# Altium project CalibradorDePlacas.PrjPcb
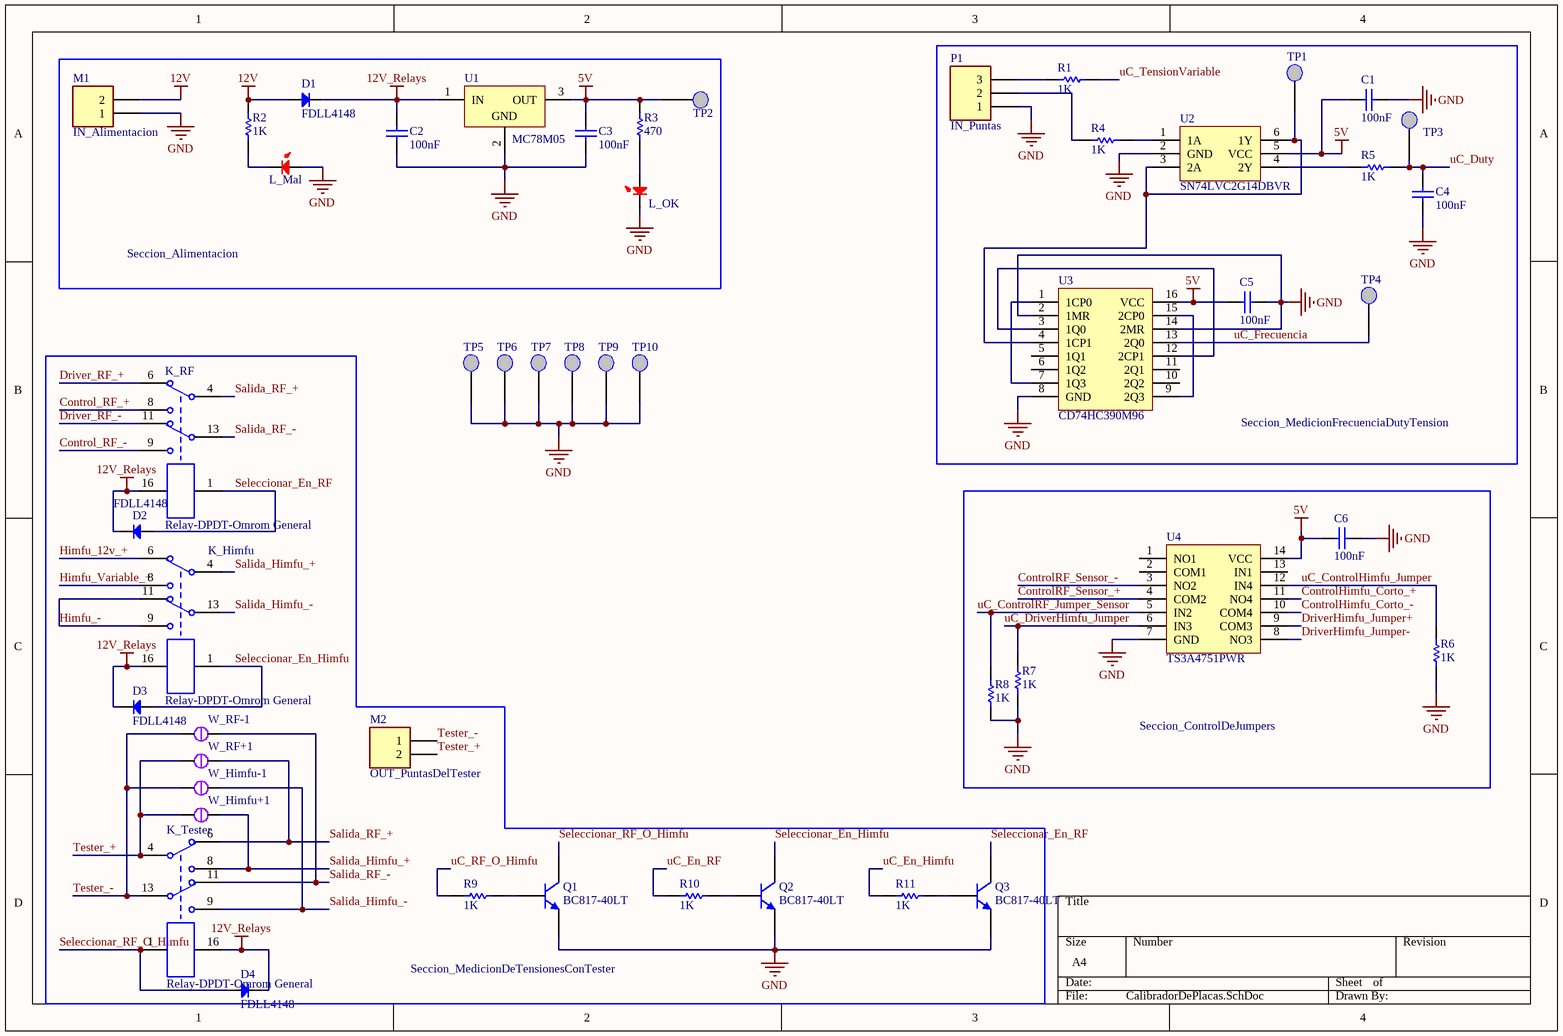
[diagram p0: CalibradorDePlacas.SchDoc]
4 sheets, 127 parts. Net scope: global (net labels, ports and power ports of the same name join across sheets).
Board file: CalibradorDePlacas.PcbDoc
Sheets:
  CalibradorDePlacas.SchDoc
  SeccionMicrocontrolador.SchDoc
  SeccionRF.SchDoc
  SeccionHimfu.SchDoc

## Sheet CalibradorDePlacas.SchDoc
size A4

### Parts
C1  100nF  [C_0805]
C2  100nF  [C_0805]
C3  100nF  [C_0805]
C4  100nF  [C_0805]
C5  100nF  [C_0805]
C6  100nF  [C_0805]
D1  FDLL4148  [SOD-80/MLL34]
D2  FDLL4148  [SOD-80/MLL34]
D3  FDLL4148  [SOD-80/MLL34]
D4  FDLL4148  [SOD-80/MLL34]
K_Himfu  Relay-DPDT-Omrom General  [RELAY_DPDT]
K_RF  Relay-DPDT-Omrom General  [RELAY_DPDT]
K_Tester  Relay-DPDT-Omrom General  [RELAY_DPDT]
L_Mal  PinesParaLed  [Jumper-Simple]  (value not drawn)
L_OK  PinesParaLed  [Jumper-Simple]  (value not drawn)
M1  IN_Alimentacion  [B2B-XH-A_3D]
M2  OUT_PuntasDelTester  [B2B-XH-A_3D]
P1  IN_Puntas  [B3B-XH-A_3D]
Q1  BC817-40LT  [SOT23]
Q2  BC817-40LT  [SOT23]
Q3  BC817-40LT  [SOT23]
R1  1K  [R_0805]
R2  1K  [R_0805]
R3  470  [R_0805]
R4  1K  [R_0805]
R5  1K  [R_0805]
R6  1K  [R_0805]
R7  1K  [R_0805]
R8  1K  [R_0805]
R9  1K  [R_0805]
R10  1K  [R_0805]
R11  1K  [R_0805]
TP1  IN_F  [TP-5002]  (value not drawn)
TP2  5V  [TP-5002]  (value not drawn)
TP3  OUT_D  [TP-5002]  (value not drawn)
TP4  OUT_F  [TP-5002]  (value not drawn)
TP5  GND  [TP-5002]  (value not drawn)
TP6  GND  [TP-5002]  (value not drawn)
TP7  GND  [TP-5002]  (value not drawn)
TP8  GND  [TP-5002]  (value not drawn)
TP9  GND  [TP-5002]  (value not drawn)
TP10  GND  [TP-5002]  (value not drawn)
U1  MC78M05  [TO-252AA_N]
U2  SN74LVC2G14DBVR  [SOT23-6]
U3  CD74HC390M96  [SOIC16]
U4  TS3A4751PWR  [TSSOP14]
W_Himfu+1  JMP  [SMD_JMP]  (value not drawn)
W_Himfu-1  JMP  [SMD_JMP]  (value not drawn)
W_RF+1  JMP  [SMD_JMP]  (value not drawn)
W_RF-1  JMP  [SMD_JMP]  (value not drawn)

### Blocks framed on the sheet
Seccion_Alimentacion: C2 C3 D1 L_Mal L_OK M1 R2 R3 TP2 U1
Seccion_MedicionFrecuenciaDutyTension: C1 C4 C5 P1 R1 R4 R5 TP1 TP3 TP4 U2 U3
Seccion_MedicionDeTensionesConTester: D2-D4 K_Himfu K_RF K_Tester M2 Q1-Q3 R9-R11 W_Himfu+1 W_Himfu-1 W_RF+1 W_RF-1
Seccion_ControlDeJumpers: C6 R6-R8 U4

### Nets
5V: C1.1 C3.2 C5.1 C6.1 R3.2 TP2.1 U1.3(OUT) U2.5(VCC) U3.16(VCC) U4.14(VCC)
12V: D1.1(A) M1.2 R2.2
12V_Relays: C2.2 D1.2(K) D2.2(K) D3.2(K) D4.2(K) K_Himfu.16(-) K_RF.16(-) K_Tester.16(-) U1.1(IN)
GND: C1.2 C2.1 C3.1 C4.1 C5.2 C6.2 L_Mal.1 L_OK.2 M1.1 P1.1 Q1.2(E) Q2.2(E) Q3.2(E) R6.1 R7.1 R8.1 TP5.1 TP6.1 TP7.1 TP8.1 TP9.1 TP10.1 U1.2(GND) U2.2(GND) U3.2(1MR) U3.8(GND) U3.14(2MR) U4.7(GND)
Control_RF_+: K_RF.8(NOb)
Control_RF_-: K_RF.9(NOa)
ControlHimfu_Corto_+: U4.11(NO4)
ControlHimfu_Corto_-: U4.10(COM4)
ControlRF_Sensor_+: U4.4(COM2)
ControlRF_Sensor_-: U4.3(NO2)
Driver_RF_+: K_RF.6(NCb)
Driver_RF_-: K_RF.11(NCa)
DriverHimfu_Jumper+: U4.9(COM3)
DriverHimfu_Jumper-: U4.8(NO3)
Himfu_12v_+: K_Himfu.6(NCb)
Himfu_-: K_Himfu.9(NOa) K_Himfu.11(NCa)
Himfu_Variable_+: K_Himfu.8(NOb)
Salida_Himfu_+: K_Himfu.4(Cb) K_Tester.8(NOb) W_Himfu+1.2
Salida_Himfu_-: K_Himfu.13(Ca) K_Tester.9(NOa) W_Himfu-1.2
Salida_RF_+: K_RF.4(Cb) K_Tester.6(NCb) W_RF+1.2
Salida_RF_-: K_RF.13(Ca) K_Tester.11(NCa) W_RF-1.2
Seleccionar_En_Himfu: D3.1(A) K_Himfu.1(+) Q2.3(C)
Seleccionar_En_RF: D2.1(A) K_RF.1(+) Q3.3(C)
Seleccionar_RF_O_Himfu: D4.1(A) K_Tester.1(+) Q1.3(C)
Tester_+: K_Tester.4(Cb) M2.2 W_Himfu+1.1 W_RF+1.1
Tester_-: K_Tester.13(Ca) M2.1 W_Himfu-1.1 W_RF-1.1
uC_ControlHimfu_Jumper: R6.2 U4.12(IN4)
uC_ControlRF_Jumper_Sensor: R8.2 U4.5(IN2)
uC_DriverHimfu_Jumper: R7.2 U4.6(IN3)
uC_Duty: C4.2 R5.2 TP3.1
uC_En_Himfu: R11.1
uC_En_RF: R10.1
uC_Frecuencia: TP4.1 U3.13(2Q0)
uC_RF_O_Himfu: R9.1
uC_TensionVariable: R1.2
NetL_Mal_2: L_Mal.2 R2.1
NetL_OK_1: L_OK.1 R3.1
NetP1_2: P1.2 R4.1
NetP1_3: P1.3 R1.1
NetQ1_1: Q1.1(B) R9.2
NetQ2_1: Q2.1(B) R10.2
NetQ3_1: Q3.1(B) R11.2
NetR4_2: R4.2 U2.1(1A)
NetR5_1: R5.1 U2.4(2Y)
NetTP1_1: TP1.1 U2.3(2A) U2.6(1Y) U3.4(1CP1)
NetU3_1: U3.1(1CP0) U3.7(1Q3)
NetU3_3: U3.3(1Q0) U3.12(2CP1)
NetU3_9: U3.9(2Q3) U3.15(2CP0)

Not connected (* = marked no-connect by the designer): U3 5(1Q1) 6(1Q2) 10(2Q2) 11(2Q1); U4 1(NO1) 2(COM1) 13(IN1)

### Library data of the parts
C1-C6 = C_100nF: CAP CER 0.1UF 25V X7R 0805; Note: Footprint corresponds to dimensions for bulk cassette packaging. This case size has tightened tolerances.; Cod.Fabricante: C0805C104M3RACTU; Fabricante: KEMET; Published: 17-Jul-2002; LatestRevisionDate: 19-Mar-2004; LatestRevisionNote: Silkscreen size reduced.; DatasheetDocument: Mar-2001; PackageDocument: Mar-2001; PackageReference: 0805; Publisher: Altium Limited; ComponentLink1Description: Manufacturer Link; ComponentLink1URL: http://www.kemet.com/; ComponentLink2Description: Datasheet; ComponentLink2URL: https://content.kemet.com/datasheets/KEM_C1002_X7R_SMD.pdf; Cod.Digikey: 399-8000-1-ND; Value: 100nF; DIGIKEYx100: 0.03160
D1-D4 = Diode FDLL4148: DIODE GEN PURP 100V 200MA LL34/SOD80/MINI MELF; Fabricante: ON Semiconductor; Published: 8-Jun-2000; LatestRevisionDate: 17-Jul-2002; LatestRevisionNote: Re-released for DXP Platform.; DatasheetDocument: 1998; PackageDocument: Aug-1999; PackageReference: MINI MELF; Publisher: Altium Limited; Code_JEDEC: MINI MELF; ComponentLink1Description: Manufacturer Link; ComponentLink1URL: https://www.fairchildsemi.com; ComponentLink2Description: Datasheet; ComponentLink2URL: https://www.fairchildsemi.com/datasheets/FD/FDLL4148.pdf; Value: FDLL4148; Cod.Digikey: FDLL4148CT-ND; Cod.Fabricante: FDLL4148; DIGIKEYx100: 0.0487
K_Himfu K_RF K_Tester = Relay-DPDT-Omrom General: RELAY GEN PURPOSE DPDT 1A 12VDC; Fabricante: Omron Electronics Inc-EMC Div; Cod.Fabricante: G5V-2-H1 DC12; Published: 24-Mar-1999; LatestRevisionDate: 17-Jul-2002; LatestRevisionNote: Re-released for DXP Platform.; PackageReference: DIP-P8; Publisher: Altium Limited; PackageDescription: Relay; 8 Leads; Cod.Digikey: Z109-ND; DIGIKEYx100: 2.38630
L_Mal L_OK = PinesParaLed: CONN HEADER 2 POS 2.54; Cod.Fabricante: 61300211121; Fabricante: Wurth Electronics Inc.; Cod.DigiKey: 732-5315-ND; ComponentLink1Description: Manufacturer Link; ComponentLink1URL: https://katalog.we-online.de/em/datasheet/6130xx11121.pdf; ComponentLink2Description: Datasheet; ComponentLink2URL: *; DatasheetVersion: *; DIGIKEYx100: 0.06700; LatestRevisionDate: *; LatestRevisionNote: *; PackageDescription: *; PackageReference: *; PackageVersion: *; Published: 29-sep-00; Publisher: Altium Limited; Value: *
M1 M2 = JST_2.5_2: CONN HEADER XH TOP 2POS 2.5MM; Cod.Fabricante: B2B-XH-A(LF)(SN); Fabricante: JST Sales America Inc.; LatestRevisionDate: 17-Jul-2002; LatestRevisionNote: Re-released for DXP Platform.; Publisher: Altium Limited; Cod.Digikey: 455-2247-ND; DIGIKEYx100: 0.0868; ComponentLink2URL: http://www.jst-mfg.com/product/pdf/eng/eXH.pdf; ComponentLink2Description: Datasheet
P1 = JST_2.5_3: CONN HEADER XH TOP 3POS 2.5MM; Cod.Fabricante: B3B-XH-A(LF)(SN); Fabricante: JST Sales America Inc.; LatestRevisionDate: 17-Jul-2002; LatestRevisionNote: Re-released for DXP Platform.; Publisher: Altium Limited; Cod.Digikey: 455-2248-ND; ComponentLink2Description: Datasheet; ComponentLink2URL: http://www.jst-mfg.com/product/pdf/eng/eXH.pdf; DIGIKEYx100: 0.1115
Q1-Q3 = BC817: TRANS NPN 45V 0.5A SOT23; Cod.Fabricante: BC817-40LT1G; Fabricante: ON Semiconductor; Published: 8-Jun-2000; LatestRevisionDate: 15-Jan-2003; LatestRevisionNote: PCB Footprint 'BCY-W3/D4.7' replaced; DatasheetVersion: 1997; PackageVersion: Sep-1998; PackageReference: SOT-23-3; Publisher: Altium Limited; PackageDescription: TO, Flat Index; 3 In-Line, Axial Leads; Body Dia. 4.5mm; Leads 0.51 x 0.48 mm (max); ComponentLink1Description: Manufacturer Link; ComponentLink1URL: http://www.onsemi.com/; ComponentLink2Description: Datasheet; ComponentLink2URL: http://www.onsemi.com/pub/Collateral/BC817-16LT1-D.PDF; Value: BC817-40LT; Cod.Digikey: BC817-40LT1GOSCT-ND; DIGIKEYx100: 0.08810
R1 R2 R4-R11 = R_1k: RES SMD 1K OHM 1% 1/8W 0805; Cod.Fabricante: RC0805FR-071KL; Fabricante: Yageo; Published: 8-Jun-2000; LatestRevisionDate: 17-Jul-2002; LatestRevisionNote: Re-released for DXP Platform.; PackageReference: 0805; Publisher: Altium Limited; Cod.Digikey: 311-1.00KCRCT-ND; Value: 1K; DIGIKEYx100: 0.01630
R3 = R_470: RES SMD 470 OHM 1% 1/8W 0805; Cod.Fabricante: RC0805FR-07470RL; Fabricante: Yageo; Published: 8-Jun-2000; LatestRevisionDate: 17-Jul-2002; LatestRevisionNote: Re-released for DXP Platform.; PackageReference: 0805; Publisher: Altium Limited; Cod.Digikey: 311-470CRCT-ND; Value: 470; DIGIKEYx100: 0.01630
TP1-TP10 = TestPoint: White PC Test Point, Miniature Phosphor Bronze, Silver Plating 0.040" (1.02mm) Hole Diameter Mounting Type; Cod.Fabricante: 5002; Fabricante: Keystone Electronics; Cod.DigiKey: 36-5002-ND; ComponentLink1Description: Manufacturer Link; ComponentLink1URL: http://www.keyelco.com/product-pdf.cfm?p=1311; ComponentLink2Description: Datasheet; ComponentLink2URL: *; DatasheetVersion: *; DIGIKEYx100: 0.22090; LatestRevisionDate: *; LatestRevisionNote: *; PackageDescription: *; PackageReference: *; PackageVersion: *; Published: 29-sep-00; Publisher: Altium Limited; Value: *
U1 = MC78M05: IC REG LINEAR 5V 500MA DPAK; Cod.Fabricante: MC78M05BDTRKG; Fabricante: ON Semiconductor; Published: 24-Aug-2001; LatestRevisionDate: 17-Jul-2002; LatestRevisionNote: Re-released for DXP Platform.; DatasheetVersion: Nov-1999; PackageReference: DPAK; Publisher: Altium Limited; PackageDescription: DPak (2 Leads + Tab); ComponentLink1Description: Manufacturer Link; ComponentLink1URL: http://www.onsemi.com; ComponentLink2Description: Datasheet; ComponentLink2URL: http://www.onsemi.com/pub/Collateral/MC78M00-D.PDF; Cod.Digikey: MC78M05BDTRKGOSCT-ND; DIGIKEYx100: 0.27660
U2 = SN74LVC2G14DBVR: IC INVERTER SCHMITT 2CH SOT23-6; Fabricante: Texas Instruments; Cod.DigiKey: 296-13010-1-ND; Cod.Fabricante: SN74LVC2G14DBVR; ComponentLink1Description: Manufacturer Link; ComponentLink1URL: http://www.ti.com/lit/ds/symlink/sn74lvc2g14.pdf; ComponentLink2Description: Datasheet; ComponentLink2URL: *; DatasheetVersion: O; DIGIKEYx100: 0.18240; LatestRevisionDate: *; LatestRevisionNote: *; PackageDescription: SOT-23-6; PackageReference: SOT-23-6; PackageVersion: *; Published: 29-sep-00; Publisher: Altium Limited; Value: SN74LVC2G14DBVR
U3 = CD74HC390M96: IC DUAL DECADE RPL COUNTR 16SOIC; Cod.DigiKey: 296-14526-1-ND; Cod.Fabricante: CD74HC390M96; ComponentLink1Description: Manufacturer Link; ComponentLink1URL: 0.43260; ComponentLink2Description: Datasheet; ComponentLink2URL: *; DatasheetVersion: *; DIGIKEYx100: 0.43260; Fabricante: *; LatestRevisionDate: *; LatestRevisionNote: *; PackageDescription: 16-SOIC (0.154", 3.90mm Width); PackageReference: 16-SOIC (0.154", 3.90mm Width); PackageVersion: *; Published: 29-sep-00; Publisher: Altium Limited; Value: CD74HC390M96
U4 = TS3A4751PWR: IC SWITCH QUAD SPST 14TSSOP; Fabricante: Texas Instruments; Cod.DigiKey: 296-20700-1-ND; Cod.Fabricante: TS3A4751PWR; ComponentLink1Description: Manufacturer Link; ComponentLink1URL: http://www.ti.com/lit/ds/symlink/ts3a4751.pdf; ComponentLink2Description: Datasheet; ComponentLink2URL: *; DatasheetVersion: F; DIGIKEYx100: 0.75680; LatestRevisionDate: *; LatestRevisionNote: *; PackageDescription: 14-TSSOP; PackageReference: 14-TSSOP; PackageVersion: *; Published: 29-sep-00; Publisher: Altium Limited; Value: TS3A4751PWR
W_Himfu+1 W_Himfu-1 W_RF+1 W_RF-1 = SMD_JMP: Islas para hacer un jumper con estaño

## Sheet SeccionMicrocontrolador.SchDoc
size A4
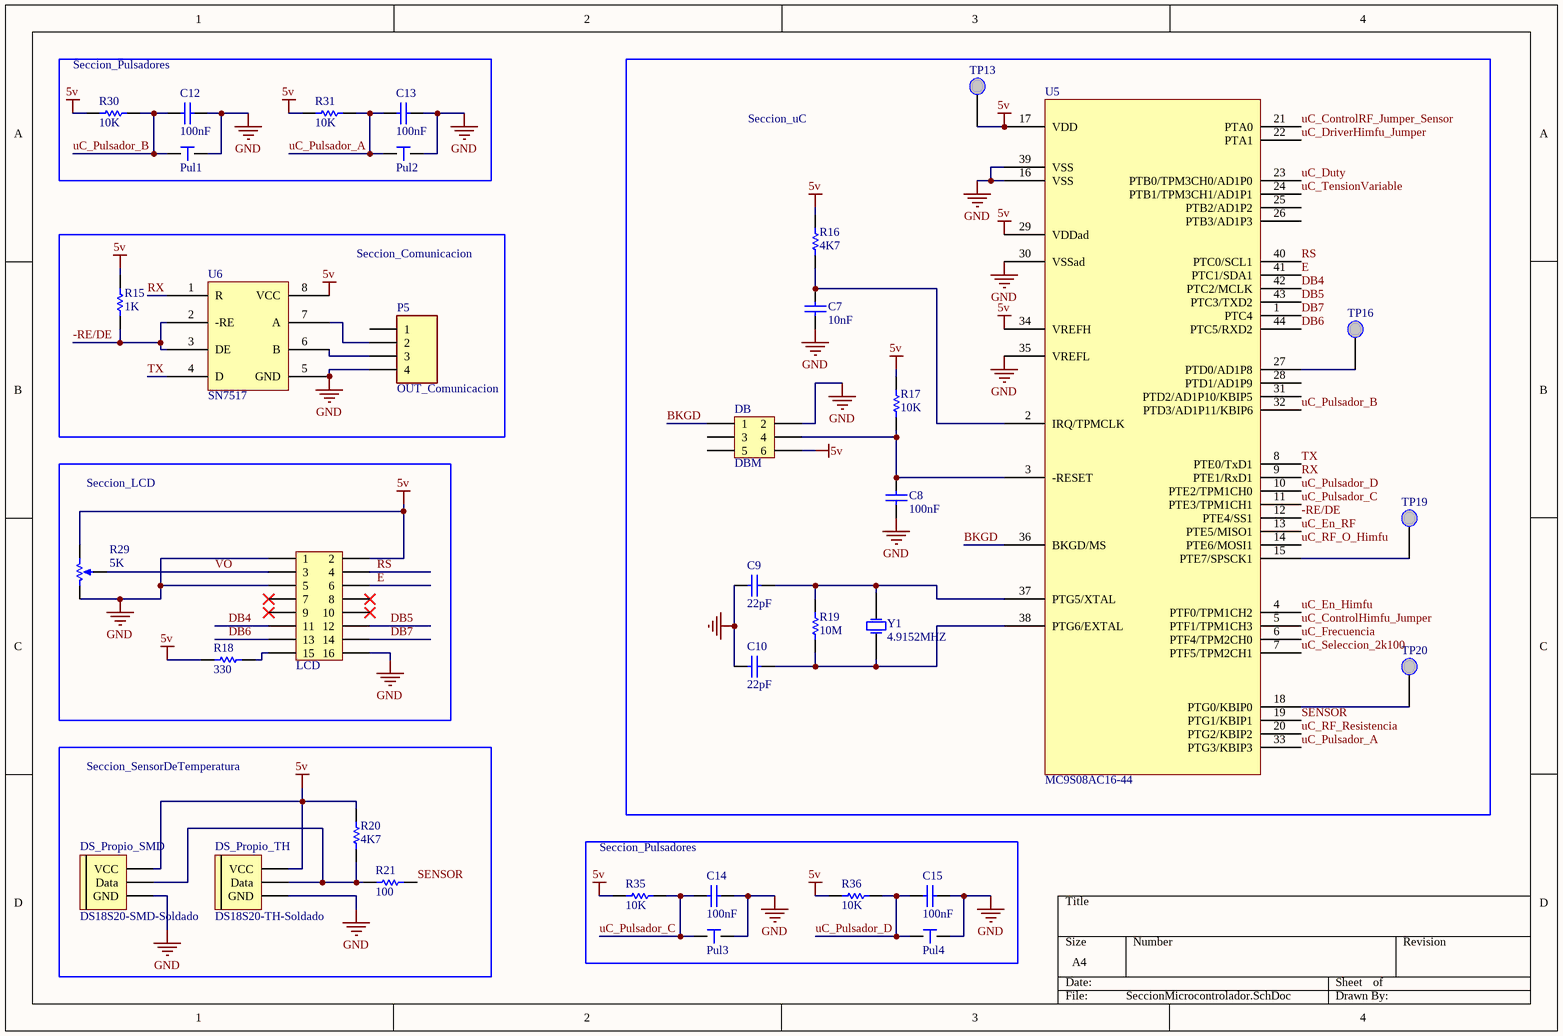
[diagram p1: SeccionMicrocontrolador.SchDoc]

### Parts
C7  10nF  [C_0805]
C8  100nF  [C_0805]
C9  22pF  [C_0805]
C10  22pF  [C_0805]
C12  100nF  [C_0805]
C13  100nF  [C_0805]
C14  100nF  [C_0805]
C15  100nF  [C_0805]
DB  DBM  [DBM]
DS_Propio_SMD  DS18S20-SMD-Soldado  [SOIC8]
DS_Propio_TH  DS18S20-TH-Soldado  [TO92]
LCD  LCD_Pines  [LCD_Pines]  (value not drawn)
P5  OUT_Comunicacion  [B4B-XH-A_3D]
Pul1  PinesParaPulsador  [Jumper-Simple]  (value not drawn)
Pul2  PinesParaPulsador  [Jumper-Simple]  (value not drawn)
Pul3  PinesParaPulsador  [Jumper-Simple]  (value not drawn)
Pul4  PinesParaPulsador  [Jumper-Simple]  (value not drawn)
R15  1K  [R_0805]
R16  4K7  [R_0805]
R17  10K  [R_0805]
R18  330  [R_0805]
R19  10M  [R_0805]
R20  4K7  [R_0805]
R21  100  [R_0805]
R29  5K  [Preset_SMD]
R30  10K  [R_0805]
R31  10K  [R_0805]
R35  10K  [R_0805]
R36  10K  [R_0805]
TP13  5V  [TP-5002]  (value not drawn)
TP16  PTD0  [TP-5002]  (value not drawn)
TP19  PTE7  [TP-5002]  (value not drawn)
TP20  PTG0  [TP-5002]  (value not drawn)
U5  MC9S08AC16-44  [QFP10x10-G44/Z14.4N]
U6  SN7517  [751-07_N]
Y1  4.9152MHZ  [XTAL_LOW]

### Blocks framed on the sheet
Seccion_Pulsadores: C12 C13 Pul1 Pul2 R30 R31
Seccion_uC: C7-C10 DB R16 R17 R19 TP13 TP16 TP19 TP20 U5 Y1
Seccion_Comunicacion: P5 R15 U6
Seccion_LCD: LCD R18 R29
Seccion_SensorDeTemperatura: DS_Propio_SMD DS_Propio_TH R20 R21
Seccion_Pulsadores: C14 C15 Pul3 Pul4 R35 R36

### Nets
5V: DB.6 DS_Propio_SMD.3(VCC) DS_Propio_TH.3(VCC) LCD.2 R15.2 R16.2 R17.2 R18.1 R20.2 R29.1(TOP_CCW) R30.2 R31.2 R35.2 R36.2 TP13.1 U5.17(VDD) U5.29(VDDad) U5.34(VREFH) U6.8(VCC)
GND: C7.1 C8.1 C9.1 C10.1 C12.1 C13.1 C14.1 C15.1 DB.2 DS_Propio_SMD.5(GND) DS_Propio_TH.1(GND) LCD.1 LCD.5 LCD.16 P5.4 Pul1.1 Pul2.1 Pul3.1 Pul4.1 R29.3(BOT_CW) U5.16(VSS) U5.30(VSSad) U5.35(VREFL) U5.39(VSS) U6.5(GND)
-RE/DE: R15.1 U5.12(PTE4/SS1) U6.2(-RE) U6.3(DE)
BKGD: DB.1 U5.36(BKGD/MS)
DB4: LCD.11 U5.42(PTC2/MCLK)
DB5: LCD.12 U5.43(PTC3/TXD2)
DB6: LCD.13 U5.44(PTC5/RXD2)
DB7: LCD.14 U5.1(PTC4)
E: LCD.6 U5.41(PTC1/SDA1)
RS: LCD.4 U5.40(PTC0/SCL1)
RX: U5.9(PTE1/RxD1) U6.1(R)
SENSOR: R21.2 U5.19(PTG1/KBIP1)
TX: U5.8(PTE0/TxD1) U6.4(D)
uC_ControlHimfu_Jumper: U5.5(PTF1/TPM1CH3)
uC_ControlRF_Jumper_Sensor: U5.21(PTA0)
uC_DriverHimfu_Jumper: U5.22(PTA1)
uC_Duty: U5.23(PTB0/TPM3CH0/AD1P0)
uC_En_Himfu: U5.4(PTF0/TPM1CH2)
uC_En_RF: U5.13(PTE5/MISO1)
uC_Frecuencia: U5.6(PTF4/TPM2CH0)
uC_Pulsador_A: C13.2 Pul2.2 R31.1 U5.33(PTG3/KBIP3)
uC_Pulsador_B: C12.2 Pul1.2 R30.1 U5.32(PTD3/AD1P11/KBIP6)
uC_Pulsador_C: C14.2 Pul3.2 R35.1 U5.11(PTE3/TPM1CH1)
uC_Pulsador_D: C15.2 Pul4.2 R36.1 U5.10(PTE2/TPM1CH0)
uC_RF_O_Himfu: U5.14(PTE6/MOSI1)
uC_RF_Resistencia: U5.20(PTG2/KBIP2)
uC_Seleccion_2k100: U5.7(PTF5/TPM2CH1)
uC_TensionVariable: U5.24(PTB1/TPM3CH1/AD1P1)
VO: LCD.3 R29.2(TAP)
NetC7_2: C7.2 R16.1 U5.2(IRQ/TPMCLK)
NetC8_2: C8.2 DB.4 R17.1 U5.3(-RESET)
NetC9_2: C9.2 R19.2 U5.37(PTG5/XTAL) Y1.2(OSC2)
NetC10_2: C10.2 R19.1 U5.38(PTG6/EXTAL) Y1.1(OSC1)
NetDS_Propio_SMD_4: DS_Propio_SMD.4(Data) DS_Propio_TH.2(Data) R20.1 R21.1
NetLCD_15: LCD.15 R18.2
NetP5_2: P5.2 U6.7(A)
NetP5_3: P5.3 U6.6(B)
NetTP16_1: TP16.1 U5.27(PTD0/AD1P8)
NetTP19_1: TP19.1 U5.15(PTE7/SPSCK1)
NetTP20_1: TP20.1 U5.18(PTG0/KBIP0)

Not connected (* = marked no-connect by the designer): DB 3 5; LCD 7* 8* 9* 10*; P5 1; U5 25(PTB2/AD1P2) 26(PTB3/AD1P3) 28(PTD1/AD1P9) 31(PTD2/AD1P10/KBIP5)

### Library data of the parts
C7 = C_10nF: CAP CER 10000PF 25V X7R 0805; Note: Footprint corresponds to dimensions for bulk cassette packaging. This case size has tightened tolerances.; Cod.Fabricante: C0805C103M3RACTU; Fabricante: KEMET; Published: 17-Jul-2002; LatestRevisionDate: 19-Mar-2004; LatestRevisionNote: Silkscreen size reduced.; DatasheetDocument: Mar-2001; PackageDocument: Mar-2001; PackageReference: 0805; Publisher: Altium Limited; ComponentLink1Description: Manufacturer Link; ComponentLink1URL: http://www.kemet.com/; ComponentLink2Description: Datasheet; ComponentLink2URL: *; Cod.Digikey: 399-9154-1-ND; Value: 10nF; DIGIKEYx100: 0.06930
C8 C12-C15 = C_100nF: as C1 on sheet CalibradorDePlacas; Published: 17-Jul-2002; LatestRevisionDate: 19-Mar-2004; LatestRevisionNote: Silkscreen size reduced.; DatasheetDocument: Mar-2001; PackageDocument: Mar-2001; PackageReference: 0805; Publisher: Altium Limited; ComponentLink1Description: Manufacturer Link; ComponentLink1URL: http://www.kemet.com/; ComponentLink2Description: Datasheet; ComponentLink2URL: https://content.kemet.com/datasheets/KEM_C1002_X7R_SMD.pdf; Cod.Digikey: 399-8000-1-ND; Value: 100nF; DIGIKEYx100: 0.03160
C9 C10 = C_22pF: CAP CER 22PF 50V C0G/NP0 0805; Note: Footprint corresponds to dimensions for bulk cassette packaging. This case size has tightened tolerances.; Cod.Fabricante: C0805C220J5GACTU; Fabricante: KEMET; Published: 17-Jul-2002; LatestRevisionDate: 19-Mar-2004; LatestRevisionNote: Silkscreen size reduced.; DatasheetDocument: Mar-2001; PackageDocument: Mar-2001; PackageReference: 0805; Publisher: Altium Limited; ComponentLink1Description: Manufacturer Link; ComponentLink1URL: http://www.kemet.com/; ComponentLink2Description: Datasheet; Cod.Digikey: 399-1113-1-ND; Value: 22pF; DIGIKEYx100: 0.03100
DB = DBM: CONN HEADER VERT 6POS 2.54MM; Cod.Fabricante: 4-103186-0-03; Fabricante: TE Connectivity AMP Connectors; Cod.DigiKey: A26529-03-ND; ComponentLink1Description: Manufacturer Link; ComponentLink1URL: https://www.te.com/commerce/DocumentDelivery/DDEController?Action=srchrtrv&DocNm=103186&DocType=Customer+Drawing&DocLang=English; ComponentLink2Description: Datasheet; ComponentLink2URL: *; DatasheetVersion: *; DIGIKEYx100: 0.44760; LatestRevisionDate: *; LatestRevisionNote: *; PackageDescription: *; PackageReference: *; PackageVersion: *; Published: 29-sep-00; Publisher: Altium Limited; Value: *
DS_Propio_SMD = DS18S20-SMD-Soldado: SENSOR DIGITAL -55C-125C 8SOIC; Cod.Fabricante: DS18S20Z+; Fabricante: Maxim Integrated; Cod.DigiKey: DS18S20Z+-ND; ComponentLink1Description: Manufacturer Link; ComponentLink1URL: https://datasheets.maximintegrated.com/en/ds/DS18S20.pdf; ComponentLink2Description: Datasheet; ComponentLink2URL: *; DatasheetVersion: *; DIGIKEYx10: 3.62160; LatestRevisionDate: *; LatestRevisionNote: *; PackageDescription: *; PackageReference: 8-SOIC; PackageVersion: *; Published: 29-sep-00; Publisher: Altium Limited; Value: DS18S20
DS_Propio_TH = DS18S20-TH-Soldado: Temperature Sensor Digital, Local -55°C ~ 125°C 8 b TO-92-3; Cod.Fabricante: DS18S20+; Fabricante: Maxim Integrated; Cod.DigiKey: DS18S20+-ND; ComponentLink1Description: Manufacturer Link; ComponentLink1URL: https://datasheets.maximintegrated.com/en/ds/DS18S20.pdf; ComponentLink2Description: Datasheet; ComponentLink2URL: *; DatasheetVersion: *; DIGIKEYx10: 2.96300; LatestRevisionDate: *; LatestRevisionNote: *; PackageDescription: *; PackageReference: TO92; PackageVersion: *; Published: 29-sep-00; Publisher: Altium Limited; Value: DS18S20
LCD = LCD_Pines: CONN HEADER VERT 16POS 2.54MM; Cod.Fabricante: 5-146257-8; Fabricante: TE Connectivity AMP Connectors; Cod.DigiKey: A121470-ND; ComponentLink1Description: Manufacturer Link; ComponentLink1URL: https://www.te.com/commerce/DocumentDelivery/DDEController?Action=srchrtrv&DocNm=103186&DocType=Customer+Drawing&DocLang=English; ComponentLink2Description: Datasheet; ComponentLink2URL: *; DatasheetVersion: *; DIGIKEYx100: 0.44760; LatestRevisionDate: *; LatestRevisionNote: *; PackageDescription: *; PackageReference: *; PackageVersion: *; Published: 29-sep-00; Publisher: Altium Limited; Value: *
P5 = JST_2.5_4: CONN HEADER XH TOP 4POS 2.5MM; Cod.Fabricante: B4B-XH-A(LF)(SN); Fabricante: JST Sales America Inc.; LatestRevisionDate: 17-Jul-2002; LatestRevisionNote: Re-released for DXP Platform.; Publisher: Altium Limited; Cod.Digikey: 455-2249-ND; ComponentLink2Description: Datasheet; ComponentLink2URL: http://www.jst-mfg.com/product/pdf/eng/eXH.pdf; DIGIKEYx100: 0.1348
Pul1-Pul4 = PinesParaPulsador: CONN HEADER 2 POS 2.54; Cod.Fabricante: 61300211121; Fabricante: Wurth Electronics Inc.; Cod.DigiKey: 732-5315-ND; ComponentLink1Description: Manufacturer Link; ComponentLink1URL: https://katalog.we-online.de/em/datasheet/6130xx11121.pdf; ComponentLink2Description: Datasheet; ComponentLink2URL: *; DatasheetVersion: *; DIGIKEYx100: 0.06700; LatestRevisionDate: *; LatestRevisionNote: *; PackageDescription: *; PackageReference: *; PackageVersion: *; Published: 29-sep-00; Publisher: Altium Limited; Value: *
R15 = R_1k: as R1 on sheet CalibradorDePlacas; Published: 8-Jun-2000; LatestRevisionDate: 17-Jul-2002; LatestRevisionNote: Re-released for DXP Platform.; PackageReference: 0805; Publisher: Altium Limited; Cod.Digikey: 311-1.00KCRCT-ND; Value: 1K; DIGIKEYx100: 0.01630
R16 R20 = R_4k7: RES SMD 4K7 OHM 1% 1/8W 0805; Cod.Fabricante: RC0805FR-074K7L; Fabricante: Yageo; Published: 8-Jun-2000; LatestRevisionDate: 17-Jul-2002; LatestRevisionNote: Re-released for DXP Platform.; PackageReference: 0805; Publisher: Altium Limited; Cod.Digikey: 311-4.70KCRCT-ND; Value: 4K7; DIGIKEYx100: 0.01630
R17 R30 R31 R35 R36 = R_10k: RES SMD 10K OHM 1% 1/8W 0805; Cod.Fabricante: RC0805FR-0710KL; Fabricante: Yageo; Published: 8-Jun-2000; LatestRevisionDate: 17-Jul-2002; LatestRevisionNote: Re-released for DXP Platform.; PackageReference: 0805; Publisher: Altium Limited; Cod.Digikey: 311-10.0KCRCT-ND; Value: 10K; DIGIKEYx100: 0.01630
R18 = R_330: RES SMD 330 OHM 1% 1/8W 0805; Cod.Fabricante: RC0805FR-07330RL; Fabricante: Yageo; Published: 8-Jun-2000; LatestRevisionDate: 17-Jul-2002; LatestRevisionNote: Re-released for DXP Platform.; PackageReference: 0805; Publisher: Altium Limited; Cod.Digikey: 311-330CRCT-ND; Value: 330; DIGIKEYx100: 0.01630
R19 = R_10M: RES SMD 10M OHM 5% 1/8W 0805; Cod.Fabricante: RC0805JR-0710ML; Fabricante: Yageo; Published: 8-Jun-2000; LatestRevisionDate: 17-Jul-2002; LatestRevisionNote: Re-released for DXP Platform.; PackageReference: 0805; Publisher: Altium Limited; Cod.Digikey: 311-10MARCT-ND; Value: 10M; DIGIKEYx100: 0.01400
R21 = R_100: RES SMD 100 OHM 1% 1/8W 0805; Cod.Fabricante: RC0805FR-07100RL; Fabricante: Yageo; Published: 8-Jun-2000; LatestRevisionDate: 17-Jul-2002; LatestRevisionNote: Re-released for DXP Platform.; PackageReference: 0805; Publisher: Altium Limited; Cod.Digikey: 311-100CRCT-ND; Value: 100; DIGIKEYx100: 0.01630
R29 = Preset_5k_SMD: TRIMMER 5K OHM 0.5W GW TOP ADJ; Cod.Fabricante: 3361P-1-502GLF; Fabricante: Bourns Inc.; Published: 8-Jun-2000; LatestRevisionDate: 17-Jul-2002; LatestRevisionNote: Re-released for DXP Platform.; PackageReference: VR5; Publisher: Altium Limited; PackageDescription: Variable Resistor, Thru-Hole; 3 Leads; Series: 3361P; Cod.Digikey: 3361P-502GLFCT-ND; DIGIKEYx100: 1.01750; Value: 5K
TP13 TP16 TP19 TP20 = TestPoint: as TP1 on sheet CalibradorDePlacas; Cod.DigiKey: 36-5002-ND; ComponentLink1Description: Manufacturer Link; ComponentLink1URL: http://www.keyelco.com/product-pdf.cfm?p=1311; ComponentLink2Description: Datasheet; ComponentLink2URL: *; DatasheetVersion: *; DIGIKEYx100: 0.22090; LatestRevisionDate: *; LatestRevisionNote: *; PackageDescription: *; PackageReference: *; PackageVersion: *; Published: 29-sep-00; Publisher: Altium Limited; Value: *
U5 = MC9S08AC16-44: S08 S08 Microcontroller IC 8-Bit 40MHz 16KB (16K x 8) FLASH 32-LQFP (7x7); Cod.Fabricante: MC9S08AC16CFGE; Fabricante: NXP; Cod.Digikey: MC9S08AC16CFGE-ND; ComponentLink1Description: Manufacturer Link; ComponentLink1URL: https://www.nxp.com/docs/en/data-sheet/MC9S08AC16.pdf; ComponentLink2Description: Datasheet; ComponentLink2URL: https://www.nxp.com/docs/en/data-sheet/MC9S08AC16.pdf; DatasheetVersion: Rev. 9; DIGIKEYx100: 4.1535; LatestRevisionDate: 8/2011; LatestRevisionNote: *; PackageDescription: *; PackageReference: *; PackageVersion: 44-LQFP; Published: *; Publisher: *; Value: MC9S08AC16-44
U6 = SN7517: IC TXRX DIFF BUSS 8SOIC; Cod.Fabricante: SN75176BDR; Fabricante: Texas Instruments; Cod.Digikey: 296-1275-1-ND; ComponentLink1Description: Manufacturer Link; ComponentLink1URL: http://www.ti.com/general/docs/suppproductinfo.tsp?distId=10&gotoUrl=http%3A%2F%2Fwww.ti.com%2Flit%2Fgpn%2Fsn65176b; ComponentLink2Description: Datasheet; ComponentLink2URL: http://www.ti.com/general/docs/suppproductinfo.tsp?distId=10&gotoUrl=http%3A%2F%2Fwww.ti.com%2Flit%2Fgpn%2Fsn65176b; DatasheetVersion: 1996; DIGIKEYx100: 1.55330; LatestRevisionDate: 17-jul-02; LatestRevisionNote: Re-released for DXP Platform.; PackageDescription: 8-SOIC; PackageReference: 8-SOIC; PackageVersion: 1996; Published: 29-sep-00; Publisher: Altium Limited; Value: SN7517
Y1 = XTAL_LOW: CRYSTAL 4.9152MHZ 18PF T/H; Cod.Fabricante: ATS049B-E; Fabricante: CTS-Frequency Controls; Cod.Digikey: CTX914-ND; ComponentLink1Description: *; ComponentLink1URL: *; ComponentLink2Description: Datasheet; ComponentLink2URL: https://www.ctscorp.com/wp-content/uploads/ATS-ATSSM.pdf; DatasheetVersion: Rev. M; DIGIKEYx100: 0.27000; LatestRevisionDate: *; LatestRevisionNote: *; PackageDescription: *; PackageReference: HC-49/US; PackageVersion: *; Published: *; Publisher: *; Value: 4.9152MHz

## Sheet SeccionRF.SchDoc
size A4
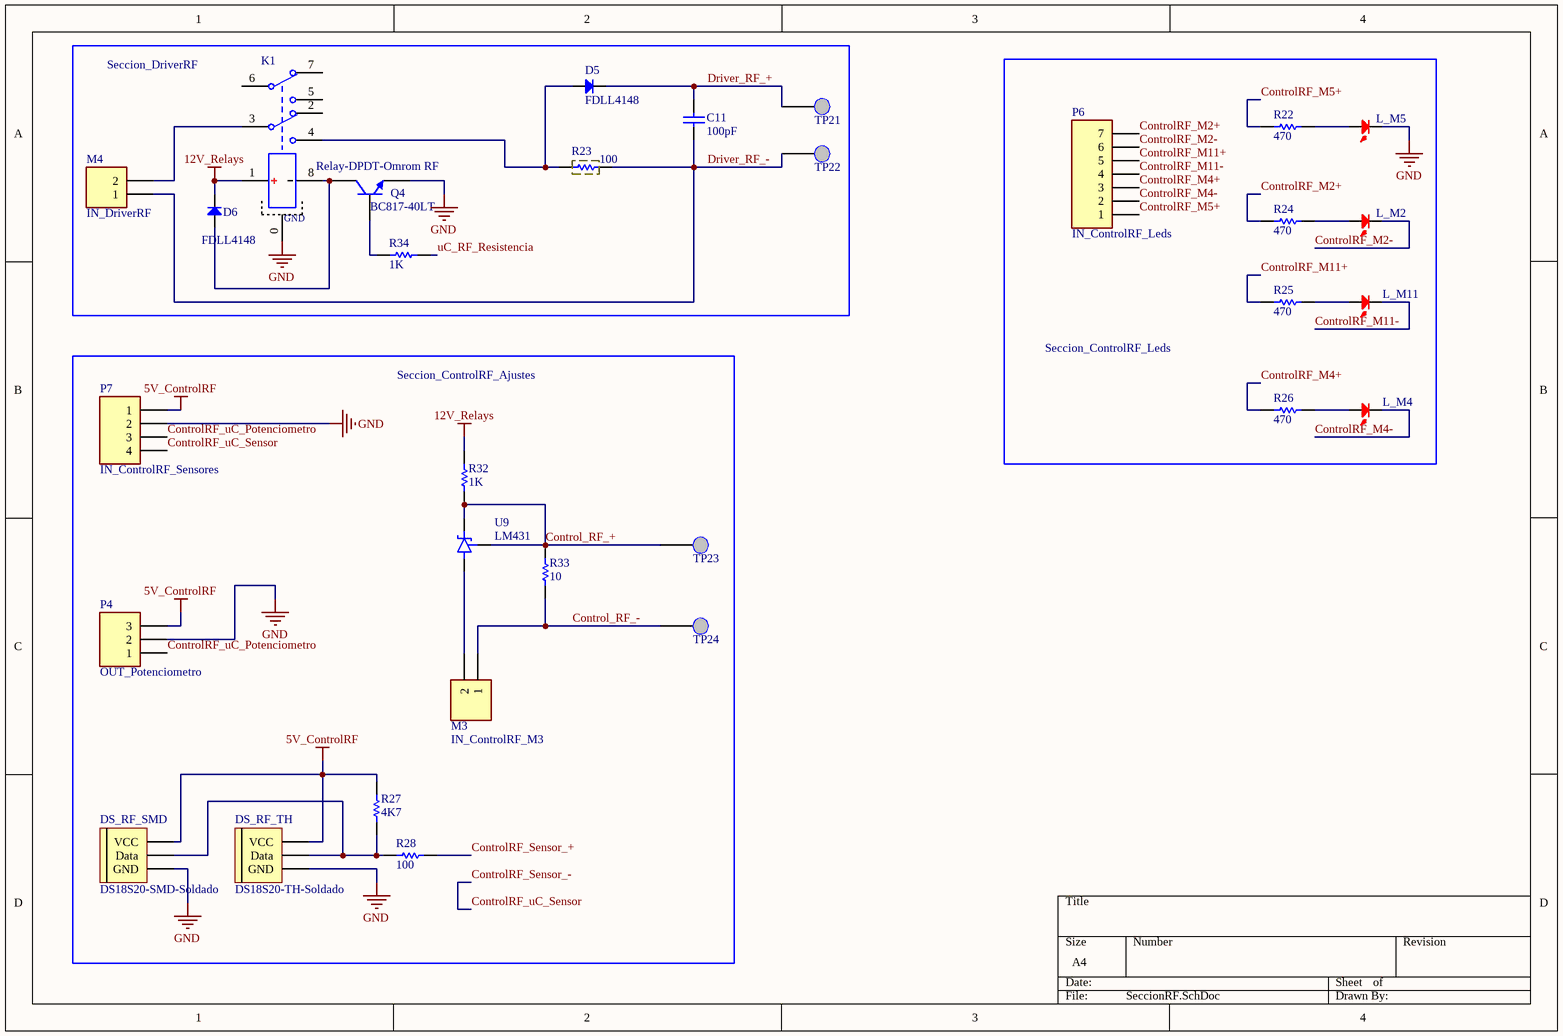
[diagram p2: SeccionRF.SchDoc]

### Parts
C11  100pF  [C_0805]
D5  FDLL4148  [SOD-80/MLL34]
D6  FDLL4148  [SOD-80/MLL34]
DS_RF_SMD  DS18S20-SMD-Soldado  [SOIC8]
DS_RF_TH  DS18S20-TH-Soldado  [TO92]
K1  Relay-DPDT-Omrom RF  [Relay RF omron]
L_M2  PinesParaLed  [Jumper-Simple]  (value not drawn)
L_M4  PinesParaLed  [Jumper-Simple]  (value not drawn)
L_M5  PinesParaLed  [Jumper-Simple]  (value not drawn)
L_M11  PinesParaLed  [Jumper-Simple]  (value not drawn)
M3  IN_ControlRF_M3  [B2B-XH-A_3D]
M4  IN_DriverRF  [B2B-XH-A_3D]
P4  OUT_Potenciometro  [B3B-XH-A_3D]
P6  IN_ControlRF_Leds  [B7B-XH-A_3D]
P7  IN_ControlRF_Sensores  [B4B-XH-A_3D]
Q4  BC817-40LT  [SOT23]
R22  470  [R_0805]
R23  100  [R 10W]
R24  470  [R_0805]
R25  470  [R_0805]
R26  470  [R_0805]
R27  4K7  [R_0805]
R28  100  [R_0805]
R32  1K  [R_0805]
R33  10  [R_0805]
R34  1K  [R_0805]
TP21  DRF+  [TP-5002]  (value not drawn)
TP22  DRF-  [TP-5002]  (value not drawn)
TP23  CRF+  [TP-5002]  (value not drawn)
TP24  CRF-  [TP-5002]  (value not drawn)
U9  LM431  [SOT89]

### Blocks framed on the sheet
Seccion_DriverRF: C11 D5 D6 K1 M4 Q4 R23 R34 TP21 TP22
Seccion_ControlRF_Leds: L_M2 L_M4 L_M5 L_M11 P6 R22 R24-R26
Seccion_ControlRF_Ajustes: DS_RF_SMD DS_RF_TH M3 P4 P7 R27 R28 R32 R33 TP23 TP24 U9

### Nets
5V_ControlRF: DS_RF_SMD.3(VCC) DS_RF_TH.3(VCC) P4.3 P7.1 R27.2
12V_Relays: D6.2(K) K1.1(+) R32.2
GND: DS_RF_SMD.5(GND) DS_RF_TH.1(GND) K1.0(GND) L_M5.2 P4.2 P7.2 Q4.2(E)
Control_RF_+: R32.1 R33.2 TP23.1 U9.1(R) U9.3(K)
Control_RF_-: M3.1 R33.1 TP24.1
ControlRF_M2+: P6.7 R24.1
ControlRF_M2-: L_M2.2 P6.6
ControlRF_M4+: P6.3 R26.1
ControlRF_M4-: L_M4.2 P6.2
ControlRF_M5+: P6.1 R22.1
ControlRF_M11+: P6.5 R25.1
ControlRF_M11-: L_M11.2 P6.4
ControlRF_Sensor_+: R28.2
ControlRF_Sensor_-: P7.4  [also labelled ControlRF_uC_Sensor]
ControlRF_uC_Potenciometro: P4.1 P7.3
Driver_RF_+: C11.2 D5.2(K) TP21.1
Driver_RF_-: C11.1 M4.1 R23.2 TP22.1
uC_RF_Resistencia: R34.1
NetD5_1: D5.1(A) K1.4(NOa) R23.1
NetD6_1: D6.1(A) K1.8(-) Q4.3(C)
NetDS_RF_SMD_4: DS_RF_SMD.4(Data) DS_RF_TH.2(Data) R27.1 R28.1
NetK1_3: K1.3(Ca) M4.2
NetL_M2_1: L_M2.1 R24.2
NetL_M4_1: L_M4.1 R26.2
NetL_M5_1: L_M5.1 R22.2
NetL_M11_1: L_M11.1 R25.2
NetM3_2: M3.2 U9.2(A)
NetQ4_1: Q4.1(B) R34.2

Not connected (* = marked no-connect by the designer): K1 2(NCa) 5(NOb) 6(Cb) 7(NCb)

### Library data of the parts
C11 = C_100pF: CAP CER 100PF 50V C0G/NP0 0805; Note: Footprint corresponds to dimensions for bulk cassette packaging. This case size has tightened tolerances.; Cod.Fabricante: C0805C101J5GACTU; Fabricante: KEMET; Published: 17-Jul-2002; LatestRevisionDate: 19-Mar-2004; LatestRevisionNote: Silkscreen size reduced.; DatasheetDocument: Mar-2001; PackageDocument: Mar-2001; PackageReference: 0805; Publisher: Altium Limited; ComponentLink1Description: Manufacturer Link; ComponentLink1URL: http://www.kemet.com/; ComponentLink2Description: Datasheet; Cod.Digikey: 399-1122-1-ND; Value: 100pF; DIGIKEYx100: 0.02980
D5 D6 = Diode FDLL4148: as D1 on sheet CalibradorDePlacas; Published: 8-Jun-2000; LatestRevisionDate: 17-Jul-2002; LatestRevisionNote: Re-released for DXP Platform.; DatasheetDocument: 1998; PackageDocument: Aug-1999; PackageReference: MINI MELF; Publisher: Altium Limited; Code_JEDEC: MINI MELF; ComponentLink1Description: Manufacturer Link; ComponentLink1URL: https://www.fairchildsemi.com; ComponentLink2Description: Datasheet; ComponentLink2URL: https://www.fairchildsemi.com/datasheets/FD/FDLL4148.pdf; Value: FDLL4148; Cod.Digikey: FDLL4148CT-ND; Cod.Fabricante: FDLL4148; DIGIKEYx100: 0.0487
DS_RF_SMD = DS18S20-SMD-Soldado: as DS_Propio_SMD on sheet SeccionMicrocontrolador; Cod.DigiKey: DS18S20Z+-ND; ComponentLink1Description: Manufacturer Link; ComponentLink1URL: https://datasheets.maximintegrated.com/en/ds/DS18S20.pdf; ComponentLink2Description: Datasheet; ComponentLink2URL: *; DatasheetVersion: *; DIGIKEYx10: 3.62160; LatestRevisionDate: *; LatestRevisionNote: *; PackageDescription: *; PackageReference: 8-SOIC; PackageVersion: *; Published: 29-sep-00; Publisher: Altium Limited; Value: DS18S20
DS_RF_TH = DS18S20-TH-Soldado: as DS_Propio_TH on sheet SeccionMicrocontrolador; Cod.DigiKey: DS18S20+-ND; ComponentLink1Description: Manufacturer Link; ComponentLink1URL: https://datasheets.maximintegrated.com/en/ds/DS18S20.pdf; ComponentLink2Description: Datasheet; ComponentLink2URL: *; DatasheetVersion: *; DIGIKEYx10: 2.96300; LatestRevisionDate: *; LatestRevisionNote: *; PackageDescription: *; PackageReference: TO92; PackageVersion: *; Published: 29-sep-00; Publisher: Altium Limited; Value: DS18S20
K1 = Relay-DPDT-Omrom RF: RELAY RF DPDT 1A 12V; Fabricante: Omron Electronics Inc-EMC Div; Cod.Fabricante: G6K-2F-RF-S DC12; Value: G6K-2F-RF-S DC12; Published: 24-Mar-1999; LatestRevisionDate: 17-Jul-2002; LatestRevisionNote: Re-released for DXP Platform.; PackageReference: DIP-P8; Publisher: Altium Limited; PackageDescription: Relay; 8 Leads; Cod.Digikey: Z2831-ND; DIGIKEYx100: 12.6118
L_M2 L_M4 L_M5 L_M11 = PinesParaLed: as L_Mal on sheet CalibradorDePlacas; Cod.DigiKey: 732-5315-ND; ComponentLink1Description: Manufacturer Link; ComponentLink1URL: https://katalog.we-online.de/em/datasheet/6130xx11121.pdf; ComponentLink2Description: Datasheet; ComponentLink2URL: *; DatasheetVersion: *; DIGIKEYx100: 0.06700; LatestRevisionDate: *; LatestRevisionNote: *; PackageDescription: *; PackageReference: *; PackageVersion: *; Published: 29-sep-00; Publisher: Altium Limited; Value: *
M3 M4 = JST_2.5_2: as M1 on sheet CalibradorDePlacas; LatestRevisionDate: 17-Jul-2002; LatestRevisionNote: Re-released for DXP Platform.; Publisher: Altium Limited; Cod.Digikey: 455-2247-ND; DIGIKEYx100: 0.0868; ComponentLink2URL: http://www.jst-mfg.com/product/pdf/eng/eXH.pdf; ComponentLink2Description: Datasheet
P4 = JST_2.5_3: as P1 on sheet CalibradorDePlacas; LatestRevisionDate: 17-Jul-2002; LatestRevisionNote: Re-released for DXP Platform.; Publisher: Altium Limited; Cod.Digikey: 455-2248-ND; ComponentLink2Description: Datasheet; ComponentLink2URL: http://www.jst-mfg.com/product/pdf/eng/eXH.pdf; DIGIKEYx100: 0.1115
P6 = JST_2.5_7: CONN HEADER XH TOP 7POS 2.5MM; Cod.Fabricante: B7B-XH-A(LF)(SN); Fabricante: JST Sales America Inc.; LatestRevisionDate: 17-Jul-2002; LatestRevisionNote: Re-released for DXP Platform.; Publisher: Altium Limited; Cod.Digikey: 455-2252-ND; ComponentLink2Description: Datasheet; ComponentLink2URL: http://www.jst-mfg.com/product/pdf/eng/eXH.pdf; DIGIKEYx100: 0.2156
P7 = JST_2.5_4: as P5 on sheet SeccionMicrocontrolador; LatestRevisionDate: 17-Jul-2002; LatestRevisionNote: Re-released for DXP Platform.; Publisher: Altium Limited; Cod.Digikey: 455-2249-ND; ComponentLink2Description: Datasheet; ComponentLink2URL: http://www.jst-mfg.com/product/pdf/eng/eXH.pdf; DIGIKEYx100: 0.1348
Q4 = BC817: as Q1 on sheet CalibradorDePlacas; Published: 8-Jun-2000; LatestRevisionDate: 15-Jan-2003; LatestRevisionNote: PCB Footprint 'BCY-W3/D4.7' replaced; DatasheetVersion: 1997; PackageVersion: Sep-1998; PackageReference: SOT-23-3; Publisher: Altium Limited; PackageDescription: TO, Flat Index; 3 In-Line, Axial Leads; Body Dia. 4.5mm; Leads 0.51 x 0.48 mm (max); ComponentLink1Description: Manufacturer Link; ComponentLink1URL: http://www.onsemi.com/; ComponentLink2Description: Datasheet; ComponentLink2URL: http://www.onsemi.com/pub/Collateral/BC817-16LT1-D.PDF; Value: BC817-40LT; Cod.Digikey: BC817-40LT1GOSCT-ND; DIGIKEYx100: 0.08810
R22 R24-R26 = R_470: as R3 on sheet CalibradorDePlacas; Published: 8-Jun-2000; LatestRevisionDate: 17-Jul-2002; LatestRevisionNote: Re-released for DXP Platform.; PackageReference: 0805; Publisher: Altium Limited; Cod.Digikey: 311-470CRCT-ND; Value: 470; DIGIKEYx100: 0.01630
R23 = Resistor-10W: RES 100 OHM 10W 5% AXIAL; Cod.Fabricante: SQP10AJB-100R; Fabricante: Yageo; Published: 8-Jun-2000; LatestRevisionDate: 17-Jul-2002; LatestRevisionNote: Re-released for DXP Platform.; PackageReference: AXIAL; Publisher: Altium Limited; PackageDescription: 0.374" x 0.354" Rectangular x 1.890" L (9.50mm x 9.00mm x 48.00mm); Value: 100; Cod.Digikey: 100W-10-ND; ComponentLink1Description: Datasheet; ComponentLink1URL: https://www.yageo.com/upload/media/product/products/datasheet/lr/Yageo_LR_SQP_NSP_1.pdf; ComponentLink2Description: Packaging specs; ComponentLink2URL: *; DatasheetVersion: *; DIGIKEYx100: 0.49250; PackageVersion: *
R27 = R_4k7: as R16 on sheet SeccionMicrocontrolador; Published: 8-Jun-2000; LatestRevisionDate: 17-Jul-2002; LatestRevisionNote: Re-released for DXP Platform.; PackageReference: 0805; Publisher: Altium Limited; Cod.Digikey: 311-4.70KCRCT-ND; Value: 4K7; DIGIKEYx100: 0.01630
R28 = R_100: as R21 on sheet SeccionMicrocontrolador; Published: 8-Jun-2000; LatestRevisionDate: 17-Jul-2002; LatestRevisionNote: Re-released for DXP Platform.; PackageReference: 0805; Publisher: Altium Limited; Cod.Digikey: 311-100CRCT-ND; Value: 100; DIGIKEYx100: 0.01630
R32 R34 = R_1k: as R1 on sheet CalibradorDePlacas; Published: 8-Jun-2000; LatestRevisionDate: 17-Jul-2002; LatestRevisionNote: Re-released for DXP Platform.; PackageReference: 0805; Publisher: Altium Limited; Cod.Digikey: 311-1.00KCRCT-ND; Value: 1K; DIGIKEYx100: 0.01630
R33 = R_10: RES SMD 10 OHM 1% 1/8W 0805; Cod.Fabricante: RC0805FR-0710RL; Fabricante: Yageo; Published: 8-Jun-2000; LatestRevisionDate: 17-Jul-2002; LatestRevisionNote: Re-released for DXP Platform.; PackageReference: 0805; Publisher: Altium Limited; Cod.Digikey: 311-10.0CRCT-ND; Value: 10; DIGIKEYx100: 0.02770
TP21-TP24 = TestPoint: as TP1 on sheet CalibradorDePlacas; Cod.DigiKey: 36-5002-ND; ComponentLink1Description: Manufacturer Link; ComponentLink1URL: http://www.keyelco.com/product-pdf.cfm?p=1311; ComponentLink2Description: Datasheet; ComponentLink2URL: *; DatasheetVersion: *; DIGIKEYx100: 0.22090; LatestRevisionDate: *; LatestRevisionNote: *; PackageDescription: *; PackageReference: *; PackageVersion: *; Published: 29-sep-00; Publisher: Altium Limited; Value: *
U9 = LM431: IC VREF SHUNT 36V 1% SOT89-3; Cod.Fabricante: LM431SBCMLX; Fabricante: ON Semiconductor; Cod.DigiKey: LM431SBCMLXCT-ND; ComponentLink1Description: Manufacturer Link; ComponentLink1URL: https://www.onsemi.com/pub/Collateral/LM431SA-D.PDF; ComponentLink2Description: Datasheet; ComponentLink2URL: *; DatasheetVersion: *; DIGIKEYx100: 0.25920; LatestRevisionDate: *; LatestRevisionNote: *; PackageDescription: SOT-89-3; PackageReference: SOT-89-3; PackageVersion: *; Published: 29-sep-00; Publisher: Altium Limited; Value: LM431

## Sheet SeccionHimfu.SchDoc
size A4
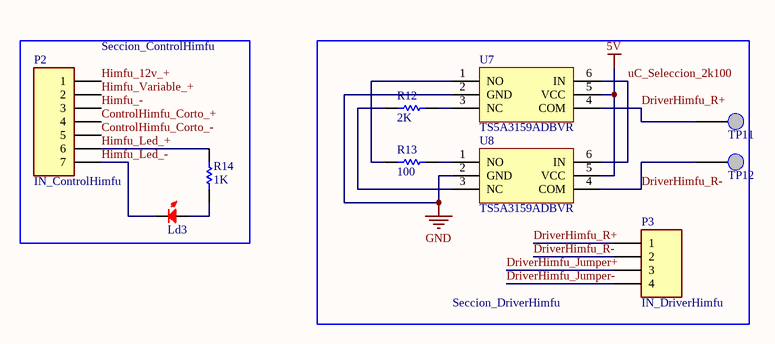
[diagram p3: SeccionHimfu.SchDoc]

### Parts
Ld3  PinesParaLed  [Jumper-Simple]  (value not drawn)
P2  IN_ControlHimfu  [B7B-XH-A_3D]
P3  IN_DriverHimfu  [B4B-XH-A_3D]
R12  2K  [R_0805]
R13  100  [R_0805]
R14  1K  [R_0805]
TP11  DRH+  [TP-5002]  (value not drawn)
TP12  DRH-  [TP-5002]  (value not drawn)
U7  TS5A3159ADBVR  [SOT23-6]
U8  TS5A3159ADBVR  [SOT23-6]

### Blocks framed on the sheet
Seccion_ControlHimfu: Ld3 P2 R14
Seccion_DriverHimfu: P3 R12 R13 TP11 TP12 U7 U8

### Nets
5V: U7.5(VCC) U8.5(VCC)
GND: U7.2(GND) U8.2(GND)
ControlHimfu_Corto_+: P2.4
ControlHimfu_Corto_-: P2.5
DriverHimfu_Jumper+: P3.3
DriverHimfu_Jumper-: P3.4
DriverHimfu_R+: P3.1 TP11.1 U7.4(COM)
DriverHimfu_R-: P3.2 TP12.1 U8.4(COM)
Himfu_12v_+: P2.1
Himfu_-: P2.3
Himfu_Led_+: P2.6 R14.2
Himfu_Led_-: Ld3.2 P2.7
Himfu_Variable_+: P2.2
uC_Seleccion_2k100: U7.6(IN) U8.6(IN)
NetLd3_1: Ld3.1 R14.1
NetR12_1: R12.1 U8.3(NC)
NetR12_2: R12.2 U7.3(NC)
NetR13_1: R13.1 U7.1(NO)
NetR13_2: R13.2 U8.1(NO)

### Library data of the parts
Ld3 = PinesParaLed: as L_Mal on sheet CalibradorDePlacas; Cod.DigiKey: 732-5315-ND; ComponentLink1Description: Manufacturer Link; ComponentLink1URL: https://katalog.we-online.de/em/datasheet/6130xx11121.pdf; ComponentLink2Description: Datasheet; ComponentLink2URL: *; DatasheetVersion: *; DIGIKEYx100: 0.06700; LatestRevisionDate: *; LatestRevisionNote: *; PackageDescription: *; PackageReference: *; PackageVersion: *; Published: 29-sep-00; Publisher: Altium Limited; Value: *
P2 = JST_2.5_7: as P6 on sheet SeccionRF; LatestRevisionDate: 17-Jul-2002; LatestRevisionNote: Re-released for DXP Platform.; Publisher: Altium Limited; Cod.Digikey: 455-2252-ND; ComponentLink2Description: Datasheet; ComponentLink2URL: http://www.jst-mfg.com/product/pdf/eng/eXH.pdf; DIGIKEYx100: 0.2156
P3 = JST_2.5_4: as P5 on sheet SeccionMicrocontrolador; LatestRevisionDate: 17-Jul-2002; LatestRevisionNote: Re-released for DXP Platform.; Publisher: Altium Limited; Cod.Digikey: 455-2249-ND; ComponentLink2Description: Datasheet; ComponentLink2URL: http://www.jst-mfg.com/product/pdf/eng/eXH.pdf; DIGIKEYx100: 0.1348
R12 = R_2k: RES SMD 2K OHM 1% 1/8W 0805; Cod.Fabricante: RC0805FR-072KL; Fabricante: Yageo; Published: 8-Jun-2000; LatestRevisionDate: 17-Jul-2002; LatestRevisionNote: Re-released for DXP Platform.; PackageReference: 0805; Publisher: Altium Limited; Cod.Digikey: 311-2.00KCRCT-ND; Value: 2K; DIGIKEYx100: 0.01630
R13 = R_100: as R21 on sheet SeccionMicrocontrolador; Published: 8-Jun-2000; LatestRevisionDate: 17-Jul-2002; LatestRevisionNote: Re-released for DXP Platform.; PackageReference: 0805; Publisher: Altium Limited; Cod.Digikey: 311-100CRCT-ND; Value: 100; DIGIKEYx100: 0.01630
R14 = R_1k: as R1 on sheet CalibradorDePlacas; Published: 8-Jun-2000; LatestRevisionDate: 17-Jul-2002; LatestRevisionNote: Re-released for DXP Platform.; PackageReference: 0805; Publisher: Altium Limited; Cod.Digikey: 311-1.00KCRCT-ND; Value: 1K; DIGIKEYx100: 0.01630
TP11 TP12 = TestPoint: as TP1 on sheet CalibradorDePlacas; Cod.DigiKey: 36-5002-ND; ComponentLink1Description: Manufacturer Link; ComponentLink1URL: http://www.keyelco.com/product-pdf.cfm?p=1311; ComponentLink2Description: Datasheet; ComponentLink2URL: *; DatasheetVersion: *; DIGIKEYx100: 0.22090; LatestRevisionDate: *; LatestRevisionNote: *; PackageDescription: *; PackageReference: *; PackageVersion: *; Published: 29-sep-00; Publisher: Altium Limited; Value: *
U7 U8 = TS5A3159ADBVR: IC SWITCH SPDT SOT23-6; Fabricante: Texas Instruments; Cod.DigiKey: 296-19265-1-ND; Cod.Fabricante: TS5A3159ADBVR; ComponentLink1Description: Manufacturer Link; ComponentLink1URL: TS5A3159ADBVR; ComponentLink2Description: Datasheet; ComponentLink2URL: *; DatasheetVersion: F; DIGIKEYx100: 0.55690; LatestRevisionDate: *; LatestRevisionNote: *; PackageDescription: SOT-23-6; PackageReference: SOT-23-6; PackageVersion: *; Published: 29-sep-00; Publisher: Altium Limited; Value: TS5A3159ADBVR

## Nets that join several sheets
5V: CalibradorDePlacas (10 pins), SeccionMicrocontrolador (19 pins), SeccionHimfu (U7.5 U8.5)
12V_Relays: CalibradorDePlacas (9 pins), SeccionRF (D6.2 K1.1 R32.2)
GND: CalibradorDePlacas (28 pins), SeccionMicrocontrolador (25 pins), SeccionRF (7 pins), SeccionHimfu (U7.2 U8.2)
Control_RF_+: CalibradorDePlacas (K_RF.8), SeccionRF (5 pins)
Control_RF_-: CalibradorDePlacas (K_RF.9), SeccionRF (M3.1 R33.1 TP24.1)
ControlHimfu_Corto_+: CalibradorDePlacas (U4.11), SeccionHimfu (P2.4)
ControlHimfu_Corto_-: CalibradorDePlacas (U4.10), SeccionHimfu (P2.5)
ControlRF_Sensor_+: CalibradorDePlacas (U4.4), SeccionRF (R28.2)
ControlRF_Sensor_-: CalibradorDePlacas (U4.3), SeccionRF (P7.4)
Driver_RF_+: CalibradorDePlacas (K_RF.6), SeccionRF (C11.2 D5.2 TP21.1)
Driver_RF_-: CalibradorDePlacas (K_RF.11), SeccionRF (C11.1 M4.1 R23.2 TP22.1)
DriverHimfu_Jumper+: CalibradorDePlacas (U4.9), SeccionHimfu (P3.3)
DriverHimfu_Jumper-: CalibradorDePlacas (U4.8), SeccionHimfu (P3.4)
Himfu_12v_+: CalibradorDePlacas (K_Himfu.6), SeccionHimfu (P2.1)
Himfu_-: CalibradorDePlacas (K_Himfu.9 K_Himfu.11), SeccionHimfu (P2.3)
Himfu_Variable_+: CalibradorDePlacas (K_Himfu.8), SeccionHimfu (P2.2)
uC_ControlHimfu_Jumper: CalibradorDePlacas (R6.2 U4.12), SeccionMicrocontrolador (U5.5)
uC_ControlRF_Jumper_Sensor: CalibradorDePlacas (R8.2 U4.5), SeccionMicrocontrolador (U5.21)
uC_DriverHimfu_Jumper: CalibradorDePlacas (R7.2 U4.6), SeccionMicrocontrolador (U5.22)
uC_Duty: CalibradorDePlacas (C4.2 R5.2 TP3.1), SeccionMicrocontrolador (U5.23)
uC_En_Himfu: CalibradorDePlacas (R11.1), SeccionMicrocontrolador (U5.4)
uC_En_RF: CalibradorDePlacas (R10.1), SeccionMicrocontrolador (U5.13)
uC_Frecuencia: CalibradorDePlacas (TP4.1 U3.13), SeccionMicrocontrolador (U5.6)
uC_RF_O_Himfu: CalibradorDePlacas (R9.1), SeccionMicrocontrolador (U5.14)
uC_RF_Resistencia: SeccionMicrocontrolador (U5.20), SeccionRF (R34.1)
uC_Seleccion_2k100: SeccionMicrocontrolador (U5.7), SeccionHimfu (U7.6 U8.6)
uC_TensionVariable: CalibradorDePlacas (R1.2), SeccionMicrocontrolador (U5.24)